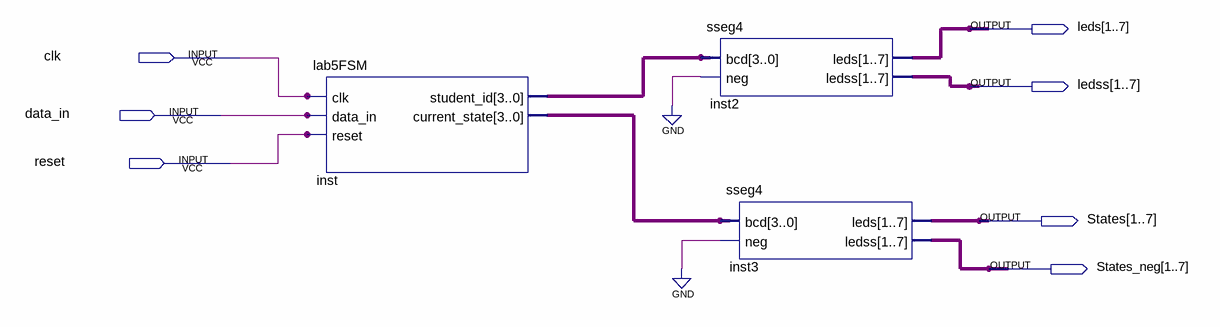
[diagram p0: schematic sheet]
// Quartus schematic lab5_2.bdf as structural Verilog: 3 symbols, 7 pins
module lab5_2 (
  input  clk,
  input  data_in,
  input  reset,
  output [1:7] leds,
  output [1:7] ledss,
  output [1:7] States,
  output [1:7] States_neg
);

  wire [3:0] inst_current_state, inst_student_id;

  lab5FSM inst (
    .clk(clk), .data_in(data_in), .reset(reset), .student_id(inst_student_id),
    .current_state(inst_current_state));
  sseg4 inst2 (.bcd(inst_student_id), .neg(1'b0), .leds(leds), .ledss(ledss));
  sseg4 inst3 (.bcd(inst_current_state), .neg(1'b0), .leds(States), .ledss(States_neg));
endmodule
